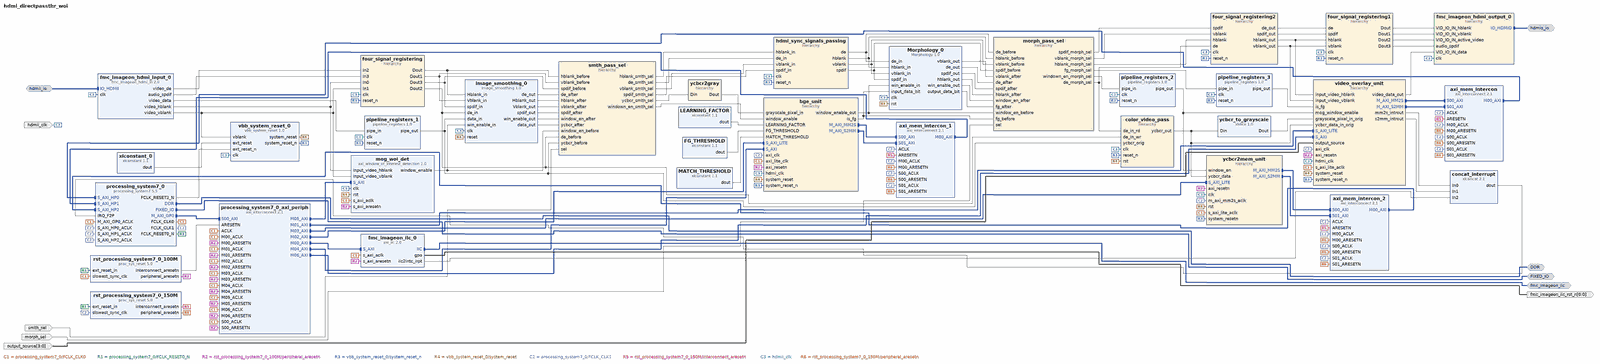
[diagram p0: block diagram of the top level, whole]
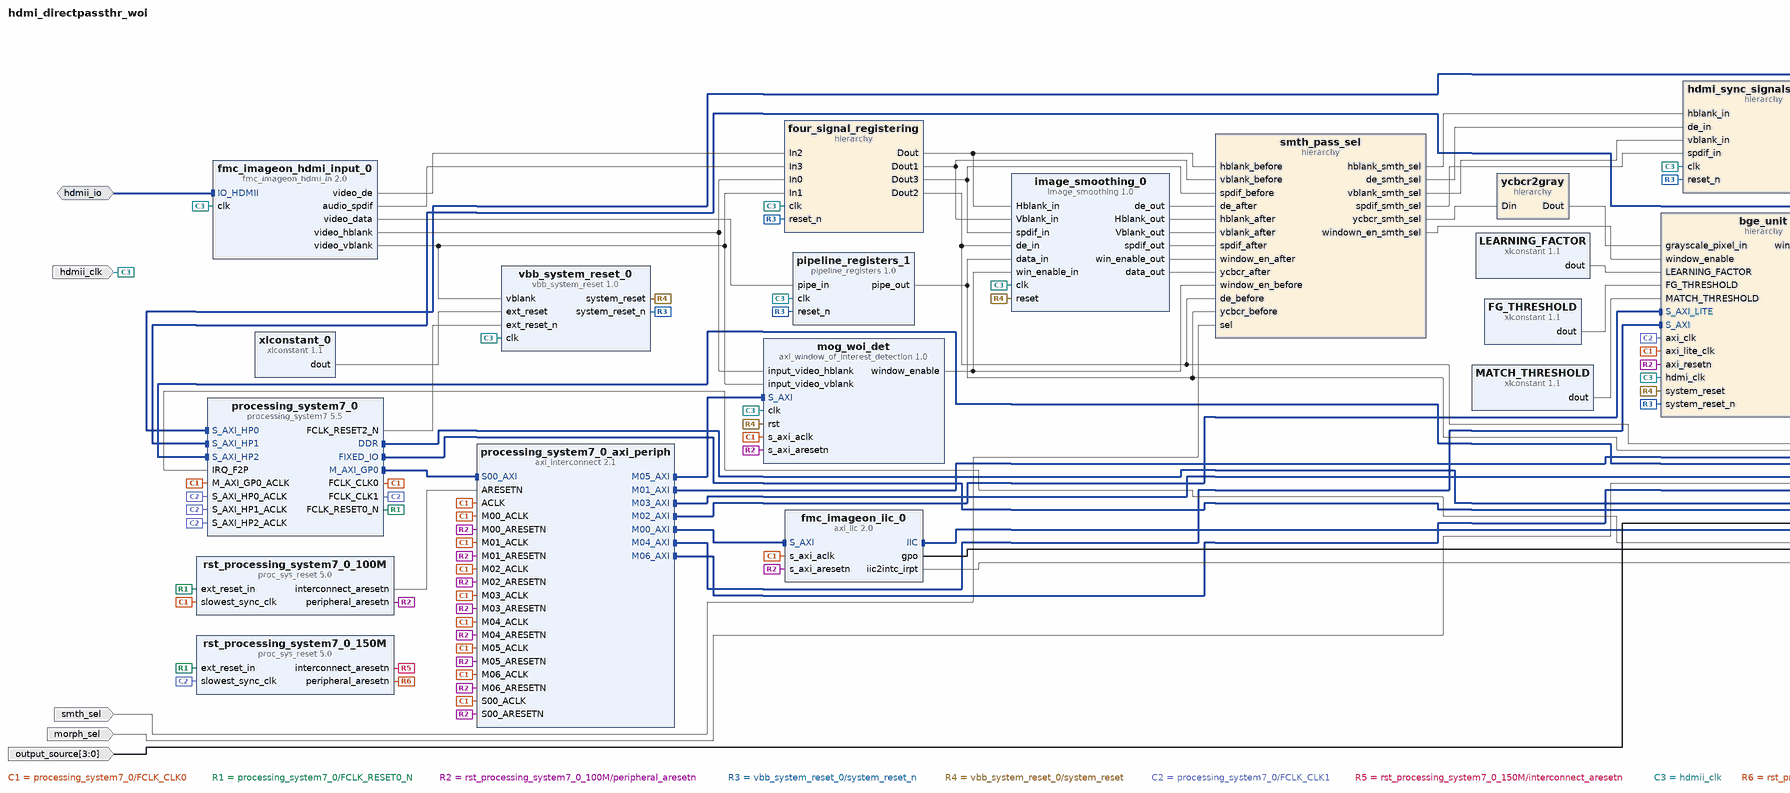
[diagram p1: block diagram of the top level, left part]
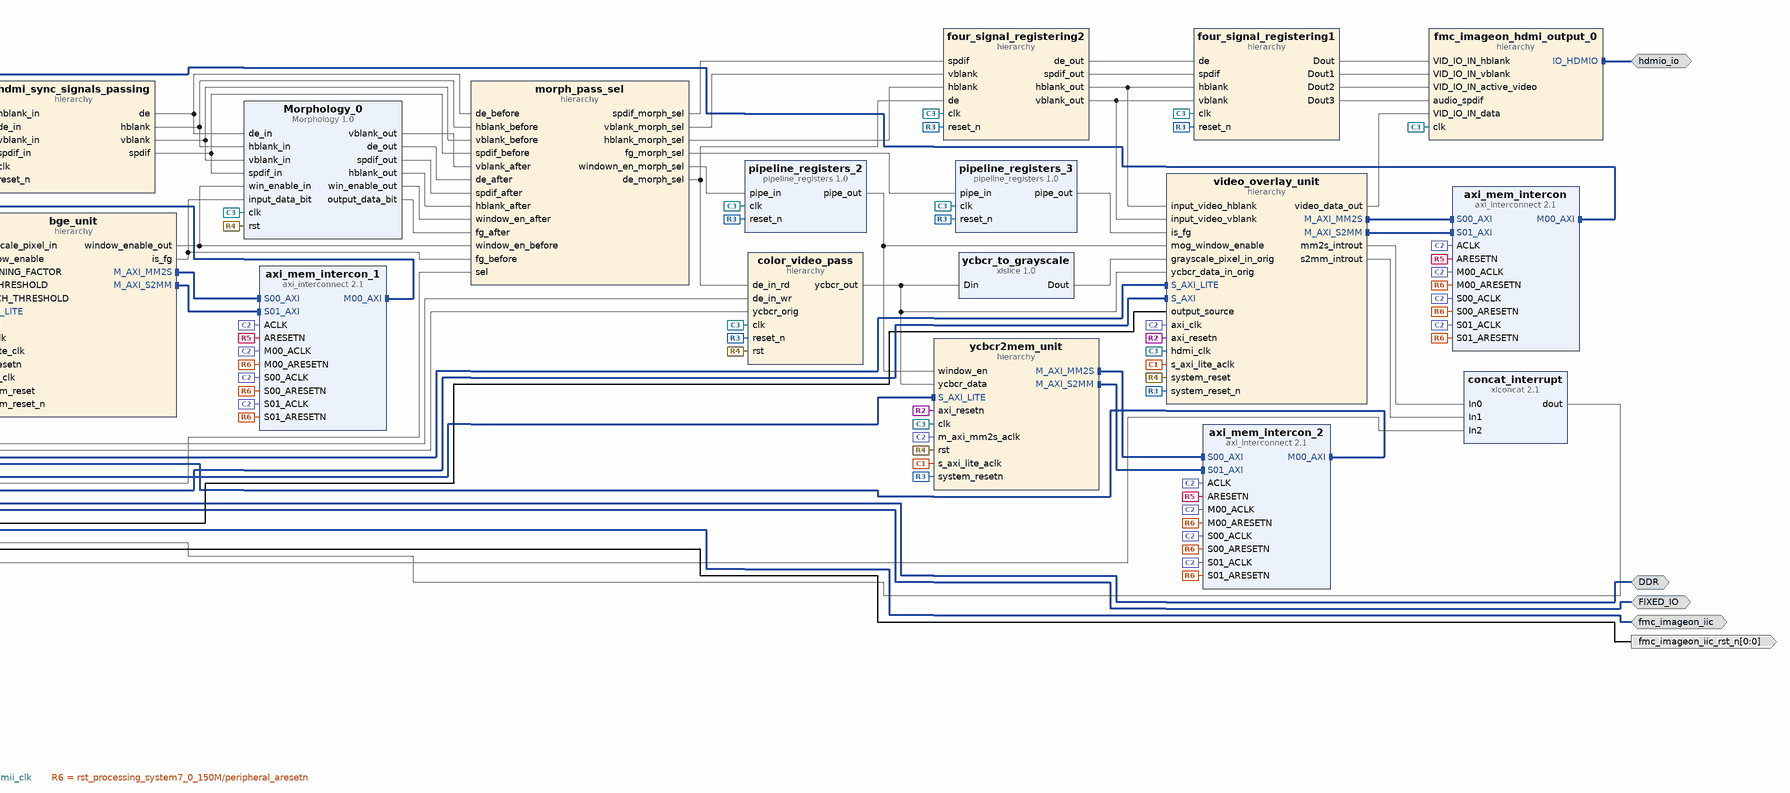
[diagram p2: block diagram of the top level, right part]
# Vivado block design hdmi_directpassthr_woi, xc7z020clg484-1, Vivado 2017.2
create_bd_design hdmi_directpassthr_woi

create_bd_intf_port -mode Master -vlnv xilinx.com:interface:ddrx_rtl:1.0 DDR
create_bd_intf_port -mode Master -vlnv xilinx.com:display_processing_system7:fixedio_rtl:1.0 FIXED_IO
create_bd_intf_port -mode Master -vlnv xilinx.com:interface:iic_rtl:1.0 fmc_imageon_iic
create_bd_intf_port -mode Slave -vlnv avnet.com:interface:avnet_hdmi_rtl:1.0 hdmii_io
create_bd_intf_port -mode Master -vlnv avnet.com:interface:avnet_hdmi_rtl:1.0 hdmio_io
create_bd_port -dir O -from 0 -to 0 fmc_imageon_iic_rst_n
create_bd_port -dir I -type clk hdmii_clk
create_bd_port -dir I smth_sel
create_bd_port -dir I morph_sel
create_bd_port -dir I -from 3 -to 0 output_source

create_bd_cell -type hier four_signal_registering
create_bd_cell -type hier four_signal_registering1
create_bd_cell -type ip -vlnv NEU-ESL:user:vbb_system_reset:1.0 vbb_system_reset_0
create_bd_cell -type hier video_overlay_unit
create_bd_cell -type hier bge_unit
create_bd_cell -type hier hdmi_sync_signals_passing
create_bd_cell -type hier color_video_pass
create_bd_cell -type ip -vlnv SchuylerEldridge:user:pipeline_registers:1.0 pipeline_registers_1
set_property -dict {CONFIG.NUMBER_OF_STAGES 2 CONFIG.BIT_WIDTH 16} [get_bd_cells pipeline_registers_1]
create_bd_cell -type hier four_signal_registering2
create_bd_cell -type ip -vlnv SchuylerEldridge:user:pipeline_registers:1.0 pipeline_registers_2
set_property -dict {CONFIG.NUMBER_OF_STAGES 1 CONFIG.BIT_WIDTH 1} [get_bd_cells pipeline_registers_2]
create_bd_cell -type ip -vlnv SchuylerEldridge:user:pipeline_registers:1.0 pipeline_registers_3
set_property -dict {CONFIG.NUMBER_OF_STAGES 1 CONFIG.BIT_WIDTH 1} [get_bd_cells pipeline_registers_3]
create_bd_cell -type ip -vlnv avnet:fmc_imageon:fmc_imageon_hdmi_in:2.0 fmc_imageon_hdmi_input_0
create_bd_cell -type hier fmc_imageon_hdmi_output_0
create_bd_cell -type hier ycbcr2gray
create_bd_cell -type hier ycbcr2mem_unit
create_bd_cell -type hier smth_pass_sel
create_bd_cell -type hier morph_pass_sel
create_bd_cell -type ip -vlnv NEU-ESL:user:axi_window_of_interest_detection:1.0 mog_woi_det
create_bd_cell -type ip -vlnv NEU-ESL:user:Morphology:1.0 Morphology_0
create_bd_cell -type ip -vlnv xilinx.com:ip:axi_iic:2.0 fmc_imageon_iic_0
create_bd_cell -type ip -vlnv xilinx.com:ip:axi_interconnect:2.1 axi_mem_intercon
set_property -dict {CONFIG.NUM_SI 2 CONFIG.NUM_MI 1} [get_bd_cells axi_mem_intercon]
create_bd_cell -type ip -vlnv xilinx.com:ip:axi_interconnect:2.1 axi_mem_intercon_1
set_property -dict {CONFIG.NUM_SI 2 CONFIG.NUM_MI 1} [get_bd_cells axi_mem_intercon_1]
create_bd_cell -type ip -vlnv xilinx.com:ip:axi_interconnect:2.1 axi_mem_intercon_2
set_property -dict {CONFIG.NUM_SI 2 CONFIG.NUM_MI 1} [get_bd_cells axi_mem_intercon_2]
create_bd_cell -type ip -vlnv NEU-ESL:user:image_smoothing:1.0 image_smoothing_0
create_bd_cell -type ip -vlnv xilinx.com:ip:processing_system7:5.5 processing_system7_0
set_property -dict [list \
  CONFIG.PCW_FCLK_CLK1_BUF TRUE \
  CONFIG.PCW_UIPARAM_DDR_FREQ_MHZ 533.333313 \
  CONFIG.PCW_APU_PERIPHERAL_FREQMHZ 666.666667 \
  CONFIG.PCW_SDIO_PERIPHERAL_FREQMHZ 50 \
  CONFIG.PCW_UART_PERIPHERAL_FREQMHZ 50 \
  CONFIG.PCW_FPGA0_PERIPHERAL_FREQMHZ 25.000000 \
  CONFIG.PCW_FPGA1_PERIPHERAL_FREQMHZ 125.000000 \
  CONFIG.PCW_USE_S_AXI_HP0 1 \
  CONFIG.PCW_USE_S_AXI_HP1 1 \
  CONFIG.PCW_USE_S_AXI_HP2 1 \
  CONFIG.PCW_M_AXI_GP0_FREQMHZ 25 \
  CONFIG.PCW_S_AXI_HP0_FREQMHZ 125 \
  CONFIG.PCW_S_AXI_HP1_FREQMHZ 125 \
  CONFIG.PCW_S_AXI_HP2_FREQMHZ 125 \
  CONFIG.PCW_USE_FABRIC_INTERRUPT 1 \
  CONFIG.PCW_S_AXI_HP0_DATA_WIDTH 32 \
  CONFIG.PCW_NUM_F2P_INTR_INPUTS 3 \
  CONFIG.PCW_EN_CLK1_PORT 1 \
  CONFIG.PCW_EN_RST2_PORT 1 \
  CONFIG.PCW_IRQ_F2P_INTR 1 \
  CONFIG.PCW_GP0_EN_MODIFIABLE_TXN 0 \
  CONFIG.PCW_GP1_EN_MODIFIABLE_TXN 0 \
  CONFIG.PCW_PRESET_BANK1_VOLTAGE {LVCMOS 1.8V} \
  CONFIG.PCW_UIPARAM_DDR_PARTNO {MT41J128M16 HA-15E} \
  CONFIG.PCW_QSPI_PERIPHERAL_ENABLE 1 \
  CONFIG.PCW_QSPI_QSPI_IO {MIO 1 .. 6} \
  CONFIG.PCW_QSPI_GRP_SINGLE_SS_ENABLE 1 \
  CONFIG.PCW_QSPI_GRP_SINGLE_SS_IO {MIO 1 .. 6} \
  CONFIG.PCW_QSPI_GRP_FBCLK_ENABLE 1 \
  CONFIG.PCW_QSPI_GRP_FBCLK_IO {MIO 8} \
  CONFIG.PCW_ENET0_PERIPHERAL_ENABLE 1 \
  CONFIG.PCW_ENET0_ENET0_IO {MIO 16 .. 27} \
  CONFIG.PCW_ENET0_GRP_MDIO_ENABLE 1 \
  CONFIG.PCW_ENET0_GRP_MDIO_IO {MIO 52 .. 53} \
  CONFIG.PCW_SD0_PERIPHERAL_ENABLE 1 \
  CONFIG.PCW_SD0_SD0_IO {MIO 40 .. 45} \
  CONFIG.PCW_SD0_GRP_CD_ENABLE 1 \
  CONFIG.PCW_SD0_GRP_CD_IO {MIO 47} \
  CONFIG.PCW_SD0_GRP_WP_ENABLE 1 \
  CONFIG.PCW_SD0_GRP_WP_IO {MIO 46} \
  CONFIG.PCW_UART1_PERIPHERAL_ENABLE 1 \
  CONFIG.PCW_UART1_UART1_IO {MIO 48 .. 49} \
  CONFIG.PCW_TRACE_INTERNAL_WIDTH 32 \
  CONFIG.PCW_TTC0_PERIPHERAL_ENABLE 1 \
  CONFIG.PCW_TTC0_TTC0_IO EMIO \
  CONFIG.PCW_USB0_PERIPHERAL_ENABLE 1 \
  CONFIG.PCW_USB0_USB0_IO {MIO 28 .. 39} \
  CONFIG.PCW_GPIO_MIO_GPIO_ENABLE 1 \
  CONFIG.PCW_GPIO_MIO_GPIO_IO MIO \
  CONFIG.preset ZedBoard \
  CONFIG.PCW_FPGA_FCLK1_ENABLE 1 \
] [get_bd_cells processing_system7_0]
# 215 more settings of processing_system7_0 are not shown: defaults, MIO pin electricals, DDR timing, and values the tool derives
create_bd_cell -type ip -vlnv xilinx.com:ip:axi_interconnect:2.1 processing_system7_0_axi_periph
set_property -dict {CONFIG.NUM_MI 7 CONFIG.ENABLE_ADVANCED_OPTIONS 0} [get_bd_cells processing_system7_0_axi_periph]
create_bd_cell -type ip -vlnv xilinx.com:ip:proc_sys_reset:5.0 rst_processing_system7_0_100M
set_property -dict {CONFIG.C_AUX_RESET_HIGH 0 CONFIG.C_EXT_RESET_HIGH 0} [get_bd_cells rst_processing_system7_0_100M]
create_bd_cell -type ip -vlnv xilinx.com:ip:proc_sys_reset:5.0 rst_processing_system7_0_150M
set_property -dict {CONFIG.C_AUX_RESET_HIGH 0 CONFIG.C_EXT_RESET_HIGH 0} [get_bd_cells rst_processing_system7_0_150M]
create_bd_cell -type ip -vlnv xilinx.com:ip:xlconcat:2.1 concat_interrupt
set_property -dict {CONFIG.NUM_PORTS 3 CONFIG.dout_width 3} [get_bd_cells concat_interrupt]
create_bd_cell -type ip -vlnv xilinx.com:ip:xlconstant:1.1 xlconstant_0
set_property -dict {CONFIG.CONST_VAL 0} [get_bd_cells xlconstant_0]
create_bd_cell -type ip -vlnv xilinx.com:ip:xlconstant:1.1 LEARNING_FACTOR
set_property -dict {CONFIG.CONST_WIDTH 16 CONFIG.CONST_VAL 5} [get_bd_cells LEARNING_FACTOR]
create_bd_cell -type ip -vlnv xilinx.com:ip:xlconstant:1.1 FG_THRESHOLD
set_property -dict {CONFIG.CONST_WIDTH 16 CONFIG.CONST_VAL 16383} [get_bd_cells FG_THRESHOLD]
create_bd_cell -type ip -vlnv xilinx.com:ip:xlconstant:1.1 MATCH_THRESHOLD
set_property -dict {CONFIG.CONST_WIDTH 8 CONFIG.CONST_VAL 85} [get_bd_cells MATCH_THRESHOLD]
create_bd_cell -type ip -vlnv xilinx.com:ip:xlslice:1.0 ycbcr_to_grayscale
set_property -dict {CONFIG.DIN_TO 8 CONFIG.DIN_FROM 15 CONFIG.DIN_WIDTH 16 CONFIG.DOUT_WIDTH 8} [get_bd_cells ycbcr_to_grayscale]

# ---- hierarchy /four_signal_registering ----
current_bd_instance /four_signal_registering
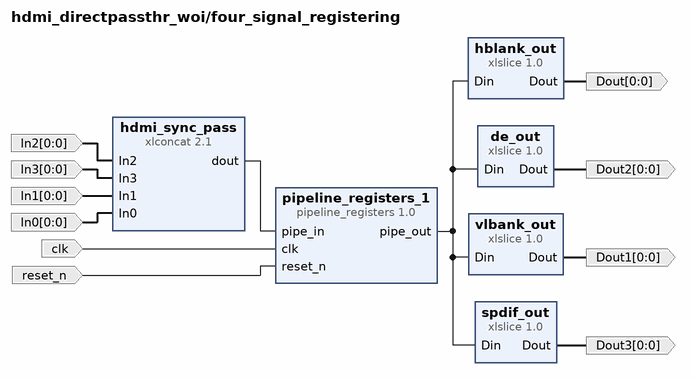
[diagram p3: block diagram inside /four_signal_registering]
create_bd_pin -dir I -from 0 -to 0 In2
create_bd_pin -dir I -from 0 -to 0 In3
create_bd_pin -dir I -from 0 -to 0 In1
create_bd_pin -dir I clk
create_bd_pin -dir I -from 0 -to 0 In0
create_bd_pin -dir I reset_n
create_bd_pin -dir O -from 0 -to 0 Dout
create_bd_pin -dir O -from 0 -to 0 Dout1
create_bd_pin -dir O -from 0 -to 0 Dout2
create_bd_pin -dir O -from 0 -to 0 Dout3

create_bd_cell -type ip -vlnv SchuylerEldridge:user:pipeline_registers:1.0 pipeline_registers_1
set_property -dict {CONFIG.NUMBER_OF_STAGES 2 CONFIG.BIT_WIDTH 4} [get_bd_cells pipeline_registers_1]
create_bd_cell -type ip -vlnv xilinx.com:ip:xlconcat:2.1 hdmi_sync_pass
set_property -dict {CONFIG.NUM_PORTS 4 CONFIG.dout_width 4} [get_bd_cells hdmi_sync_pass]
create_bd_cell -type ip -vlnv xilinx.com:ip:xlslice:1.0 hblank_out
set_property -dict {CONFIG.DIN_WIDTH 4} [get_bd_cells hblank_out]
create_bd_cell -type ip -vlnv xilinx.com:ip:xlslice:1.0 vlbank_out
set_property -dict {CONFIG.DIN_TO 1 CONFIG.DIN_FROM 1 CONFIG.DIN_WIDTH 4} [get_bd_cells vlbank_out]
create_bd_cell -type ip -vlnv xilinx.com:ip:xlslice:1.0 de_out
set_property -dict {CONFIG.DIN_TO 2 CONFIG.DIN_FROM 2 CONFIG.DIN_WIDTH 4} [get_bd_cells de_out]
create_bd_cell -type ip -vlnv xilinx.com:ip:xlslice:1.0 spdif_out
set_property -dict {CONFIG.DIN_TO 3 CONFIG.DIN_FROM 3 CONFIG.DIN_WIDTH 4} [get_bd_cells spdif_out]

# ---- hierarchy /four_signal_registering1 ----
current_bd_instance /four_signal_registering1
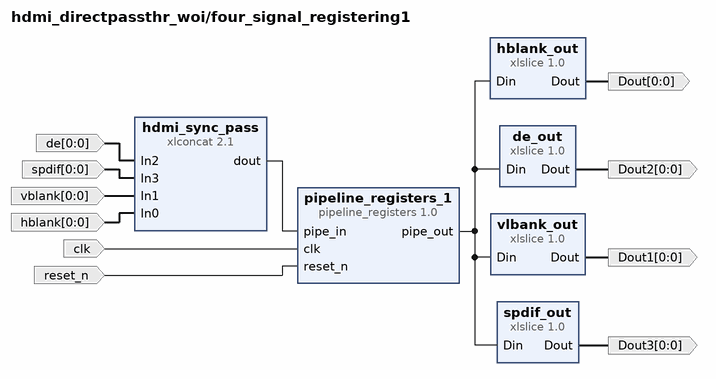
[diagram p4: block diagram inside /four_signal_registering1]
create_bd_pin -dir I -from 0 -to 0 de
create_bd_pin -dir I -from 0 -to 0 spdif
create_bd_pin -dir I -from 0 -to 0 vblank
create_bd_pin -dir I clk
create_bd_pin -dir I -from 0 -to 0 hblank
create_bd_pin -dir I reset_n
create_bd_pin -dir O -from 0 -to 0 Dout
create_bd_pin -dir O -from 0 -to 0 Dout1
create_bd_pin -dir O -from 0 -to 0 Dout2
create_bd_pin -dir O -from 0 -to 0 Dout3

create_bd_cell -type ip -vlnv SchuylerEldridge:user:pipeline_registers:1.0 pipeline_registers_1
set_property -dict {CONFIG.NUMBER_OF_STAGES 4 CONFIG.BIT_WIDTH 4} [get_bd_cells pipeline_registers_1]
create_bd_cell -type ip -vlnv xilinx.com:ip:xlslice:1.0 de_out
set_property -dict {CONFIG.DIN_TO 2 CONFIG.DIN_FROM 2 CONFIG.DIN_WIDTH 4} [get_bd_cells de_out]
create_bd_cell -type ip -vlnv xilinx.com:ip:xlslice:1.0 hblank_out
set_property -dict {CONFIG.DIN_WIDTH 4} [get_bd_cells hblank_out]
create_bd_cell -type ip -vlnv xilinx.com:ip:xlconcat:2.1 hdmi_sync_pass
set_property -dict {CONFIG.NUM_PORTS 4 CONFIG.dout_width 4} [get_bd_cells hdmi_sync_pass]
create_bd_cell -type ip -vlnv xilinx.com:ip:xlslice:1.0 spdif_out
set_property -dict {CONFIG.DIN_TO 3 CONFIG.DIN_FROM 3 CONFIG.DIN_WIDTH 4} [get_bd_cells spdif_out]
create_bd_cell -type ip -vlnv xilinx.com:ip:xlslice:1.0 vlbank_out
set_property -dict {CONFIG.DIN_TO 1 CONFIG.DIN_FROM 1 CONFIG.DIN_WIDTH 4} [get_bd_cells vlbank_out]

# ---- hierarchy /video_overlay_unit ----
current_bd_instance /video_overlay_unit
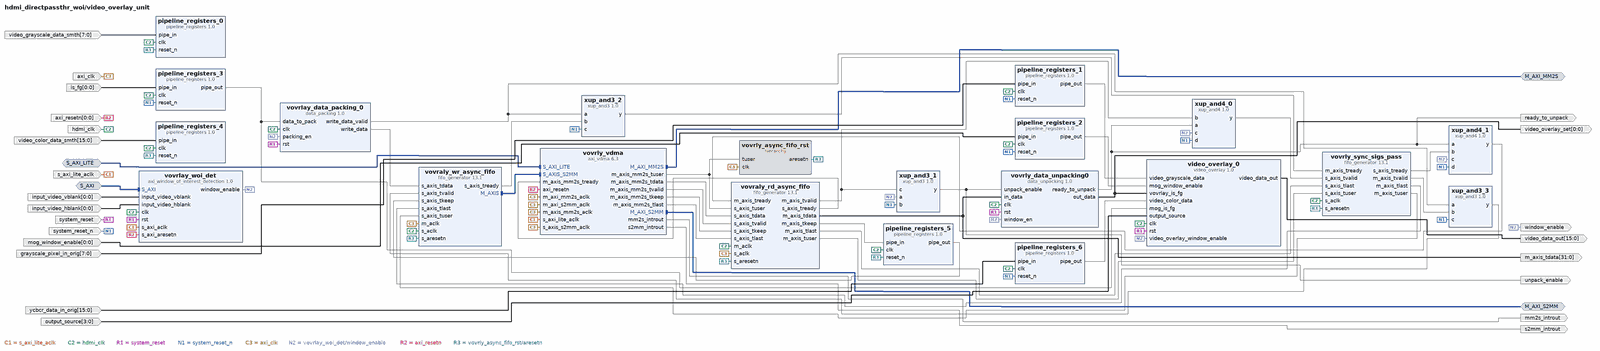
[diagram p5: block diagram inside /video_overlay_unit, whole]
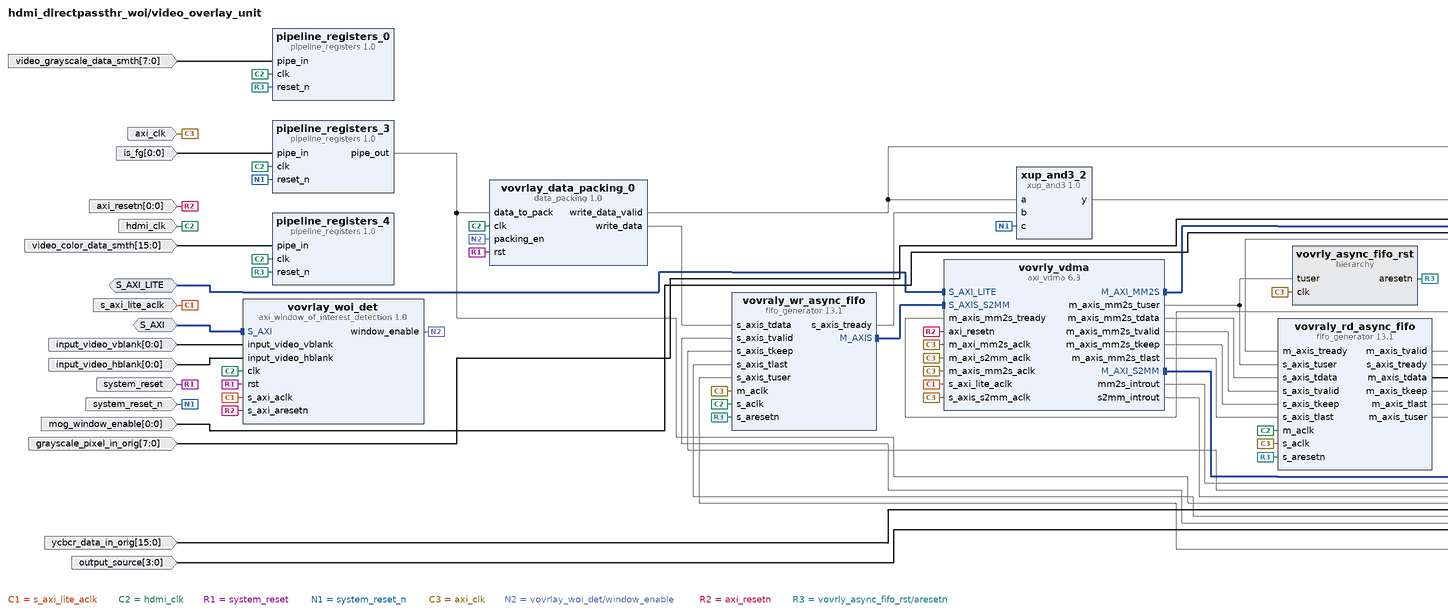
[diagram p6: block diagram inside /video_overlay_unit, left part]
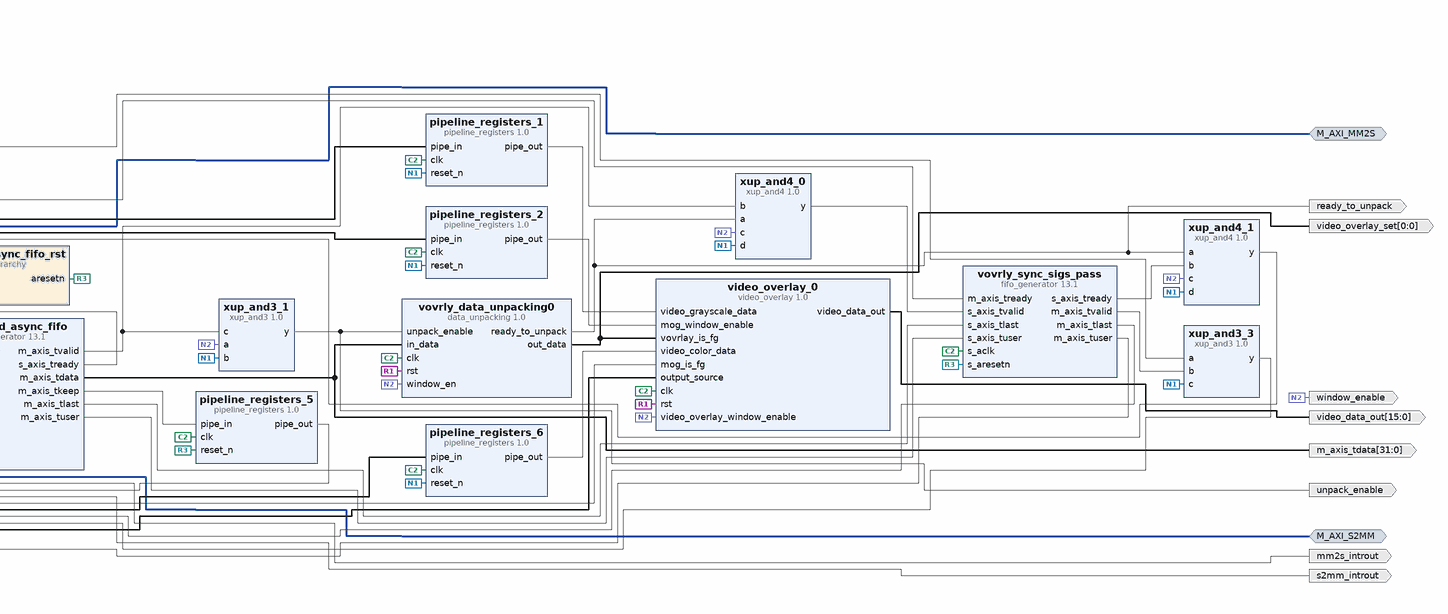
[diagram p7: block diagram inside /video_overlay_unit, right part]
create_bd_intf_pin -mode Master -vlnv xilinx.com:interface:aximm_rtl:1.0 M_AXI_MM2S
create_bd_intf_pin -mode Slave -vlnv xilinx.com:interface:aximm_rtl:1.0 S_AXI_LITE
create_bd_intf_pin -mode Master -vlnv xilinx.com:interface:aximm_rtl:1.0 M_AXI_S2MM
create_bd_intf_pin -mode Slave -vlnv xilinx.com:interface:aximm_rtl:1.0 S_AXI
create_bd_pin -dir I -type clk s_axi_lite_aclk
create_bd_pin -dir I hdmi_clk
create_bd_pin -dir I system_reset
create_bd_pin -dir I system_reset_n
create_bd_pin -dir O -from 15 -to 0 video_data_out
create_bd_pin -dir I -type clk axi_clk
create_bd_pin -dir I -from 0 -to 0 mog_window_enable
create_bd_pin -dir I -from 7 -to 0 grayscale_pixel_in_orig
create_bd_pin -dir I -from 0 -to 0 input_video_hblank
create_bd_pin -dir I -from 0 -to 0 input_video_vblank
create_bd_pin -dir I -from 0 -to 0 -type rst axi_resetn
create_bd_pin -dir O -from 31 -to 0 m_axis_tdata
create_bd_pin -dir O unpack_enable
create_bd_pin -dir O window_enable
create_bd_pin -dir O ready_to_unpack
create_bd_pin -dir O -from 0 -to 0 video_overlay_set
create_bd_pin -dir I -from 0 -to 0 is_fg
create_bd_pin -dir I -from 15 -to 0 ycbcr_data_in_orig
create_bd_pin -dir I -from 7 -to 0 video_grayscale_data_smth
create_bd_pin -dir I -from 15 -to 0 video_color_data_smth
create_bd_pin -dir O -type intr mm2s_introut
create_bd_pin -dir O -type intr s2mm_introut
create_bd_pin -dir I -from 3 -to 0 output_source

create_bd_cell -type ip -vlnv SchuylerEldridge:user:pipeline_registers:1.0 pipeline_registers_1
set_property -dict {CONFIG.NUMBER_OF_STAGES 3 CONFIG.BIT_WIDTH 8} [get_bd_cells pipeline_registers_1]
create_bd_cell -type ip -vlnv SchuylerEldridge:user:pipeline_registers:1.0 pipeline_registers_2
set_property -dict {CONFIG.NUMBER_OF_STAGES 3 CONFIG.BIT_WIDTH 1} [get_bd_cells pipeline_registers_2]
create_bd_cell -type ip -vlnv xilinx.com:xup:xup_and3:1.0 xup_and3_1
create_bd_cell -type hier vovrly_async_fifo_rst
create_bd_cell -type ip -vlnv SchuylerEldridge:user:pipeline_registers:1.0 pipeline_registers_3
set_property -dict {CONFIG.NUMBER_OF_STAGES 3 CONFIG.BIT_WIDTH 1} [get_bd_cells pipeline_registers_3]
create_bd_cell -type ip -vlnv xilinx.com:xup:xup_and4:1.0 xup_and4_0
create_bd_cell -type ip -vlnv xilinx.com:xup:xup_and3:1.0 xup_and3_2
create_bd_cell -type ip -vlnv xilinx.com:xup:xup_and3:1.0 xup_and3_3
create_bd_cell -type ip -vlnv NEU-ESL:user:data_packing:1.0 vovrlay_data_packing_0
create_bd_cell -type ip -vlnv xilinx.com:xup:xup_and4:1.0 xup_and4_1
create_bd_cell -type ip -vlnv SchuylerEldridge:user:pipeline_registers:1.0 pipeline_registers_5
set_property -dict {CONFIG.NUMBER_OF_STAGES 32 CONFIG.BIT_WIDTH 4} [get_bd_cells pipeline_registers_5]
create_bd_cell -type ip -vlnv SchuylerEldridge:user:pipeline_registers:1.0 pipeline_registers_6
set_property -dict {CONFIG.NUMBER_OF_STAGES 3 CONFIG.BIT_WIDTH 16} [get_bd_cells pipeline_registers_6]
create_bd_cell -type ip -vlnv NEU-ESL:user:data_unpacking:1.0 vovrly_data_unpacking0
set_property -dict {CONFIG.OUT_DATA_WIDTH 1} [get_bd_cells vovrly_data_unpacking0]
create_bd_cell -type ip -vlnv SchuylerEldridge:user:pipeline_registers:1.0 pipeline_registers_0
set_property -dict {CONFIG.NUMBER_OF_STAGES 3 CONFIG.BIT_WIDTH 8} [get_bd_cells pipeline_registers_0]
create_bd_cell -type ip -vlnv SchuylerEldridge:user:pipeline_registers:1.0 pipeline_registers_4
set_property -dict {CONFIG.NUMBER_OF_STAGES 3 CONFIG.BIT_WIDTH 16} [get_bd_cells pipeline_registers_4]
create_bd_cell -type ip -vlnv NEU-ESL:user:axi_window_of_interest_detection:1.0 vovrlay_woi_det
create_bd_cell -type ip -vlnv xilinx.com:ip:axi_vdma:6.3 vovrly_vdma
set_property -dict [list \
  CONFIG.c_m_axi_mm2s_data_width 32 \
  CONFIG.c_m_axi_s2mm_data_width 32 \
  CONFIG.c_num_fstores 2 \
  CONFIG.c_use_s2mm_fsync 0 \
  CONFIG.c_mm2s_genlock_mode 0 \
  CONFIG.c_s2mm_genlock_mode 0 \
  CONFIG.c_mm2s_linebuffer_depth 2048 \
  CONFIG.c_s2mm_linebuffer_depth 2048 \
  CONFIG.c_mm2s_max_burst_length 16 \
  CONFIG.c_s2mm_max_burst_length 16 \
  CONFIG.c_include_s2mm 1 \
  CONFIG.c_include_mm2s_dre 0 \
] [get_bd_cells vovrly_vdma]
create_bd_cell -type ip -vlnv xilinx.com:ip:fifo_generator:13.1 vovraly_rd_async_fifo
set_property -dict [list \
  CONFIG.INTERFACE_TYPE AXI_STREAM \
  CONFIG.Full_Flags_Reset_Value 1 \
  CONFIG.Clock_Type_AXI Independent_Clock \
  CONFIG.TDATA_NUM_BYTES 4 \
  CONFIG.TUSER_WIDTH 1 \
  CONFIG.Enable_TLAST true \
  CONFIG.HAS_TKEEP true \
  CONFIG.FIFO_Implementation_wach Independent_Clocks_Distributed_RAM \
  CONFIG.FIFO_Implementation_wdch Independent_Clocks_Block_RAM \
  CONFIG.FIFO_Implementation_wrch Independent_Clocks_Distributed_RAM \
  CONFIG.FIFO_Implementation_rach Independent_Clocks_Distributed_RAM \
  CONFIG.FIFO_Implementation_rdch Independent_Clocks_Block_RAM \
  CONFIG.FIFO_Implementation_axis Independent_Clocks_Block_RAM \
  CONFIG.Input_Depth_axis 1024 \
  CONFIG.Underflow_Flag_AXI false \
  CONFIG.Overflow_Flag_AXI false \
] [get_bd_cells vovraly_rd_async_fifo]
create_bd_cell -type ip -vlnv xilinx.com:ip:fifo_generator:13.1 vovrly_sync_sigs_pass
set_property -dict [list \
  CONFIG.INTERFACE_TYPE AXI_STREAM \
  CONFIG.Full_Flags_Reset_Value 1 \
  CONFIG.TDATA_NUM_BYTES 0 \
  CONFIG.TUSER_WIDTH 1 \
  CONFIG.Enable_TLAST true \
  CONFIG.FIFO_Implementation_wach Common_Clock_Distributed_RAM \
  CONFIG.FIFO_Implementation_wrch Common_Clock_Distributed_RAM \
  CONFIG.FIFO_Implementation_rach Common_Clock_Distributed_RAM \
  CONFIG.Input_Depth_axis 64 \
  CONFIG.Underflow_Flag_AXI true \
  CONFIG.Overflow_Flag_AXI true \
] [get_bd_cells vovrly_sync_sigs_pass]
create_bd_cell -type ip -vlnv xilinx.com:ip:fifo_generator:13.1 vovraly_wr_async_fifo
set_property -dict [list \
  CONFIG.INTERFACE_TYPE AXI_STREAM \
  CONFIG.Full_Flags_Reset_Value 1 \
  CONFIG.Clock_Type_AXI Independent_Clock \
  CONFIG.TDATA_NUM_BYTES 4 \
  CONFIG.TUSER_WIDTH 1 \
  CONFIG.Enable_TLAST true \
  CONFIG.HAS_TKEEP true \
  CONFIG.FIFO_Implementation_wach Independent_Clocks_Distributed_RAM \
  CONFIG.FIFO_Implementation_wdch Independent_Clocks_Block_RAM \
  CONFIG.FIFO_Implementation_wrch Independent_Clocks_Distributed_RAM \
  CONFIG.FIFO_Implementation_rach Independent_Clocks_Distributed_RAM \
  CONFIG.FIFO_Implementation_rdch Independent_Clocks_Block_RAM \
  CONFIG.FIFO_Implementation_axis Independent_Clocks_Block_RAM \
  CONFIG.Input_Depth_axis 512 \
  CONFIG.Underflow_Flag_AXI true \
  CONFIG.Overflow_Flag_AXI true \
] [get_bd_cells vovraly_wr_async_fifo]
create_bd_cell -type ip -vlnv www.northeastern.edu:user:video_overlay:1.0 video_overlay_0

# ---- hierarchy /video_overlay_unit/vovrly_async_fifo_rst ----
current_bd_instance /video_overlay_unit/vovrly_async_fifo_rst
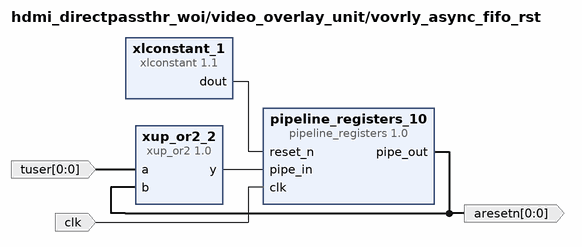
[diagram p8: block diagram inside /video_overlay_unit/vovrly_async_fifo_rst]
create_bd_pin -dir I clk
create_bd_pin -dir O -from 0 -to 0 aresetn
create_bd_pin -dir I -from 0 -to 0 tuser

create_bd_cell -type ip -vlnv SchuylerEldridge:user:pipeline_registers:1.0 pipeline_registers_10
set_property -dict {CONFIG.NUMBER_OF_STAGES 1 CONFIG.BIT_WIDTH 1} [get_bd_cells pipeline_registers_10]
create_bd_cell -type ip -vlnv xilinx.com:xup:xup_or2:1.0 xup_or2_2
create_bd_cell -type ip -vlnv xilinx.com:ip:xlconstant:1.1 xlconstant_1

# ---- hierarchy /bge_unit ----
current_bd_instance /bge_unit
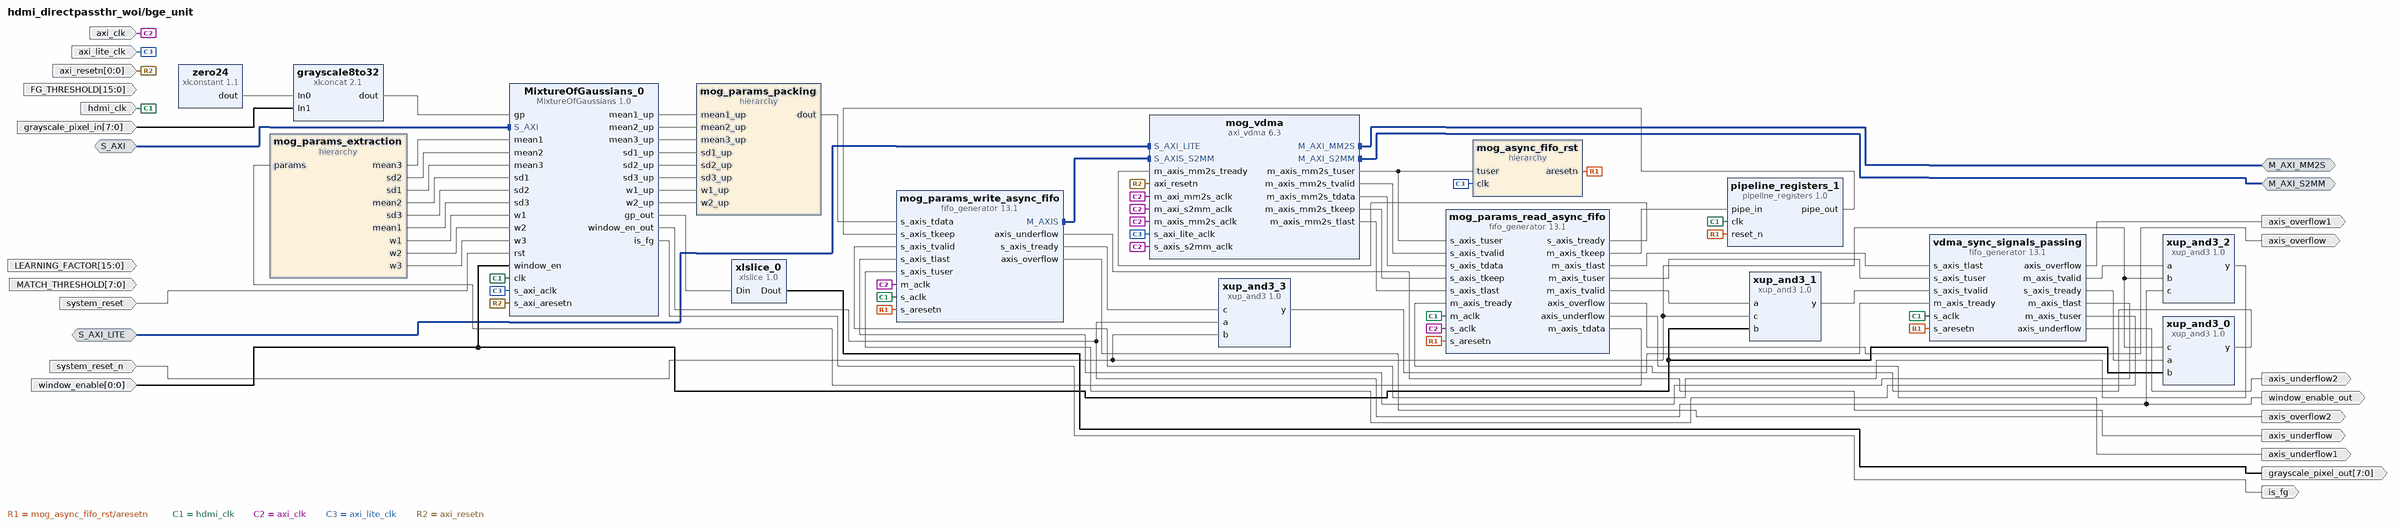
[diagram p9: block diagram inside /bge_unit]
create_bd_intf_pin -mode Slave -vlnv xilinx.com:interface:aximm_rtl:1.0 S_AXI_LITE
create_bd_intf_pin -mode Master -vlnv xilinx.com:interface:aximm_rtl:1.0 M_AXI_MM2S
create_bd_intf_pin -mode Master -vlnv xilinx.com:interface:aximm_rtl:1.0 M_AXI_S2MM
create_bd_intf_pin -mode Slave -vlnv xilinx.com:interface:aximm_rtl:1.0 S_AXI
create_bd_pin -dir I axi_lite_clk
create_bd_pin -dir I -from 0 -to 0 -type rst axi_resetn
create_bd_pin -dir I system_reset
create_bd_pin -dir I system_reset_n
create_bd_pin -dir I -type clk hdmi_clk
create_bd_pin -dir I -type clk axi_clk
create_bd_pin -dir I -from 7 -to 0 MATCH_THRESHOLD
create_bd_pin -dir I -from 7 -to 0 grayscale_pixel_in
create_bd_pin -dir I -from 0 -to 0 window_enable
create_bd_pin -dir I -from 15 -to 0 LEARNING_FACTOR
create_bd_pin -dir I -from 15 -to 0 FG_THRESHOLD
create_bd_pin -dir O window_enable_out
create_bd_pin -dir O -from 7 -to 0 grayscale_pixel_out
create_bd_pin -dir O is_fg
create_bd_pin -dir O axis_overflow
create_bd_pin -dir O axis_underflow
create_bd_pin -dir O axis_underflow1
create_bd_pin -dir O axis_overflow1
create_bd_pin -dir O axis_underflow2
create_bd_pin -dir O axis_overflow2

create_bd_cell -type ip -vlnv SchuylerEldridge:user:pipeline_registers:1.0 pipeline_registers_1
set_property -dict {CONFIG.NUMBER_OF_STAGES 80 CONFIG.BIT_WIDTH 16} [get_bd_cells pipeline_registers_1]
create_bd_cell -type hier mog_params_packing
create_bd_cell -type hier mog_params_extraction
create_bd_cell -type hier mog_async_fifo_rst
create_bd_cell -type ip -vlnv xilinx.com:xup:xup_and3:1.0 xup_and3_0
create_bd_cell -type ip -vlnv xilinx.com:xup:xup_and3:1.0 xup_and3_1
create_bd_cell -type ip -vlnv xilinx.com:xup:xup_and3:1.0 xup_and3_2
create_bd_cell -type ip -vlnv xilinx.com:xup:xup_and3:1.0 xup_and3_3
create_bd_cell -type ip -vlnv NEU-ESL:user:MixtureOfGaussians:1.0 MixtureOfGaussians_0
create_bd_cell -type ip -vlnv xilinx.com:ip:axi_vdma:6.3 mog_vdma
set_property -dict [list \
  CONFIG.c_m_axi_mm2s_data_width 128 \
  CONFIG.c_m_axis_mm2s_tdata_width 128 \
  CONFIG.c_m_axi_s2mm_data_width 128 \
  CONFIG.c_s_axis_s2mm_tdata_width 128 \
  CONFIG.c_num_fstores 1 \
  CONFIG.c_use_s2mm_fsync 0 \
  CONFIG.c_mm2s_genlock_mode 0 \
  CONFIG.c_s2mm_genlock_mode 0 \
  CONFIG.c_mm2s_linebuffer_depth 4096 \
  CONFIG.c_s2mm_linebuffer_depth 4096 \
  CONFIG.c_mm2s_max_burst_length 256 \
  CONFIG.c_s2mm_max_burst_length 256 \
] [get_bd_cells mog_vdma]
create_bd_cell -type ip -vlnv xilinx.com:ip:fifo_generator:13.1 mog_params_read_async_fifo
set_property -dict [list \
  CONFIG.INTERFACE_TYPE AXI_STREAM \
  CONFIG.Full_Flags_Reset_Value 1 \
  CONFIG.Clock_Type_AXI Independent_Clock \
  CONFIG.TDATA_NUM_BYTES 16 \
  CONFIG.TUSER_WIDTH 1 \
  CONFIG.Enable_TLAST true \
  CONFIG.HAS_TKEEP true \
  CONFIG.FIFO_Implementation_wach Independent_Clocks_Distributed_RAM \
  CONFIG.FIFO_Implementation_wdch Independent_Clocks_Block_RAM \
  CONFIG.FIFO_Implementation_wrch Independent_Clocks_Distributed_RAM \
  CONFIG.FIFO_Implementation_rach Independent_Clocks_Distributed_RAM \
  CONFIG.FIFO_Implementation_rdch Independent_Clocks_Block_RAM \
  CONFIG.FIFO_Implementation_axis Independent_Clocks_Block_RAM \
  CONFIG.Input_Depth_axis 1024 \
  CONFIG.Underflow_Flag_AXI true \
  CONFIG.Overflow_Flag_AXI true \
] [get_bd_cells mog_params_read_async_fifo]
create_bd_cell -type ip -vlnv xilinx.com:ip:fifo_generator:13.1 mog_params_write_async_fifo
set_property -dict [list \
  CONFIG.INTERFACE_TYPE AXI_STREAM \
  CONFIG.Full_Flags_Reset_Value 1 \
  CONFIG.Clock_Type_AXI Independent_Clock \
  CONFIG.TDATA_NUM_BYTES 16 \
  CONFIG.TUSER_WIDTH 1 \
  CONFIG.Enable_TLAST true \
  CONFIG.HAS_TKEEP true \
  CONFIG.FIFO_Implementation_wach Independent_Clocks_Distributed_RAM \
  CONFIG.FIFO_Implementation_wdch Independent_Clocks_Block_RAM \
  CONFIG.FIFO_Implementation_wrch Independent_Clocks_Distributed_RAM \
  CONFIG.FIFO_Implementation_rach Independent_Clocks_Distributed_RAM \
  CONFIG.FIFO_Implementation_rdch Independent_Clocks_Block_RAM \
  CONFIG.FIFO_Implementation_axis Independent_Clocks_Block_RAM \
  CONFIG.Input_Depth_axis 1024 \
  CONFIG.Underflow_Flag_AXI true \
  CONFIG.Overflow_Flag_AXI true \
] [get_bd_cells mog_params_write_async_fifo]
create_bd_cell -type ip -vlnv xilinx.com:ip:fifo_generator:13.1 vdma_sync_signals_passing
set_property -dict [list \
  CONFIG.INTERFACE_TYPE AXI_STREAM \
  CONFIG.Full_Flags_Reset_Value 1 \
  CONFIG.TDATA_NUM_BYTES 0 \
  CONFIG.TUSER_WIDTH 1 \
  CONFIG.Enable_TLAST true \
  CONFIG.FIFO_Implementation_wach Common_Clock_Distributed_RAM \
  CONFIG.FIFO_Implementation_wrch Common_Clock_Distributed_RAM \
  CONFIG.FIFO_Implementation_rach Common_Clock_Distributed_RAM \
  CONFIG.Input_Depth_axis 128 \
  CONFIG.Underflow_Flag_AXI true \
  CONFIG.Overflow_Flag_AXI true \
] [get_bd_cells vdma_sync_signals_passing]
create_bd_cell -type ip -vlnv xilinx.com:ip:xlconcat:2.1 grayscale8to32
set_property -dict {CONFIG.IN0_WIDTH 24 CONFIG.IN1_WIDTH 8 CONFIG.dout_width 32} [get_bd_cells grayscale8to32]
create_bd_cell -type ip -vlnv xilinx.com:ip:xlconstant:1.1 zero24
set_property -dict {CONFIG.CONST_WIDTH 24 CONFIG.CONST_VAL 0} [get_bd_cells zero24]
create_bd_cell -type ip -vlnv xilinx.com:ip:xlslice:1.0 xlslice_0
set_property -dict {CONFIG.DIN_TO 24 CONFIG.DIN_FROM 31 CONFIG.DOUT_WIDTH 8} [get_bd_cells xlslice_0]

# ---- hierarchy /bge_unit/mog_params_packing ----
current_bd_instance /bge_unit/mog_params_packing
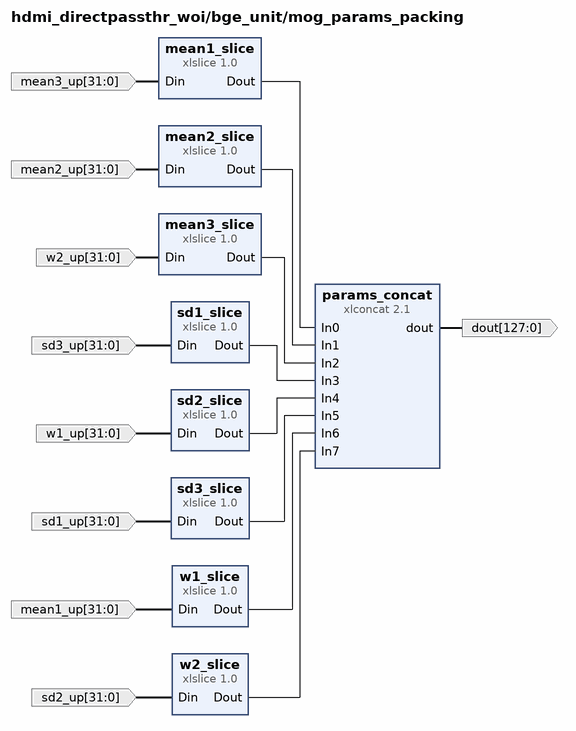
[diagram p10: block diagram inside /bge_unit/mog_params_packing]
create_bd_pin -dir I -from 31 -to 0 w2_up
create_bd_pin -dir I -from 31 -to 0 w1_up
create_bd_pin -dir I -from 31 -to 0 mean3_up
create_bd_pin -dir I -from 31 -to 0 sd1_up
create_bd_pin -dir I -from 31 -to 0 mean2_up
create_bd_pin -dir I -from 31 -to 0 mean1_up
create_bd_pin -dir I -from 31 -to 0 sd3_up
create_bd_pin -dir I -from 31 -to 0 sd2_up
create_bd_pin -dir O -from 127 -to 0 dout

create_bd_cell -type ip -vlnv xilinx.com:ip:xlslice:1.0 sd1_slice
set_property -dict {CONFIG.DIN_TO 16 CONFIG.DIN_FROM 31 CONFIG.DOUT_WIDTH 16} [get_bd_cells sd1_slice]
create_bd_cell -type ip -vlnv xilinx.com:ip:xlslice:1.0 w1_slice
set_property -dict {CONFIG.DIN_TO 16 CONFIG.DIN_FROM 31 CONFIG.DOUT_WIDTH 16} [get_bd_cells w1_slice]
create_bd_cell -type ip -vlnv xilinx.com:ip:xlslice:1.0 w2_slice
set_property -dict {CONFIG.DIN_TO 16 CONFIG.DIN_FROM 31 CONFIG.DOUT_WIDTH 16} [get_bd_cells w2_slice]
create_bd_cell -type ip -vlnv xilinx.com:ip:xlslice:1.0 sd3_slice
set_property -dict {CONFIG.DIN_TO 16 CONFIG.DIN_FROM 31 CONFIG.DOUT_WIDTH 16} [get_bd_cells sd3_slice]
create_bd_cell -type ip -vlnv xilinx.com:ip:xlslice:1.0 mean2_slice
set_property -dict {CONFIG.DIN_TO 16 CONFIG.DIN_FROM 31 CONFIG.DOUT_WIDTH 16} [get_bd_cells mean2_slice]
create_bd_cell -type ip -vlnv xilinx.com:ip:xlslice:1.0 sd2_slice
set_property -dict {CONFIG.DIN_TO 16 CONFIG.DIN_FROM 31 CONFIG.DOUT_WIDTH 16} [get_bd_cells sd2_slice]
create_bd_cell -type ip -vlnv xilinx.com:ip:xlslice:1.0 mean3_slice
set_property -dict {CONFIG.DIN_TO 16 CONFIG.DIN_FROM 31 CONFIG.DOUT_WIDTH 16} [get_bd_cells mean3_slice]
create_bd_cell -type ip -vlnv xilinx.com:ip:xlconcat:2.1 params_concat
set_property -dict [list \
  CONFIG.NUM_PORTS 8 \
  CONFIG.IN0_WIDTH 16 \
  CONFIG.IN1_WIDTH 16 \
  CONFIG.IN2_WIDTH 16 \
  CONFIG.IN3_WIDTH 16 \
  CONFIG.IN4_WIDTH 16 \
  CONFIG.IN5_WIDTH 16 \
  CONFIG.IN6_WIDTH 16 \
  CONFIG.IN7_WIDTH 16 \
  CONFIG.dout_width 128 \
] [get_bd_cells params_concat]
create_bd_cell -type ip -vlnv xilinx.com:ip:xlslice:1.0 mean1_slice
set_property -dict {CONFIG.DIN_TO 16 CONFIG.DIN_FROM 31 CONFIG.DOUT_WIDTH 16} [get_bd_cells mean1_slice]

# ---- hierarchy /bge_unit/mog_params_extraction ----
current_bd_instance /bge_unit/mog_params_extraction
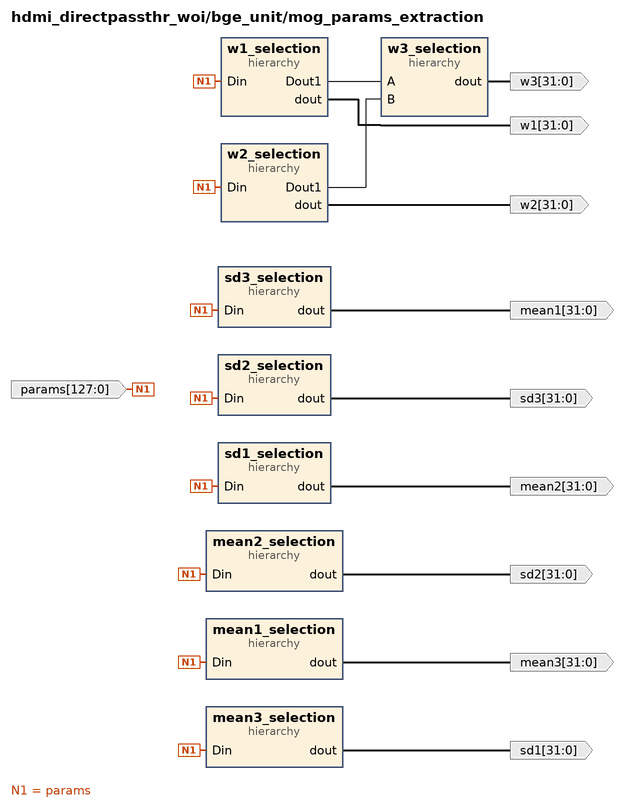
[diagram p11: block diagram inside /bge_unit/mog_params_extraction]
create_bd_pin -dir O -from 31 -to 0 -type data w1
create_bd_pin -dir O -from 31 -to 0 mean1
create_bd_pin -dir O -from 31 -to 0 sd3
create_bd_pin -dir O -from 31 -to 0 mean2
create_bd_pin -dir O -from 31 -to 0 -type data w2
create_bd_pin -dir I -from 127 -to 0 params
create_bd_pin -dir O -from 31 -to 0 sd2
create_bd_pin -dir O -from 31 -to 0 mean3
create_bd_pin -dir O -from 31 -to 0 sd1
create_bd_pin -dir O -from 31 -to 0 w3

create_bd_cell -type hier mean2_selection
create_bd_cell -type hier sd3_selection
create_bd_cell -type hier mean3_selection
create_bd_cell -type hier mean1_selection
create_bd_cell -type hier sd1_selection
create_bd_cell -type hier sd2_selection
create_bd_cell -type hier w2_selection
create_bd_cell -type hier w1_selection
create_bd_cell -type hier w3_selection

# ---- hierarchy /bge_unit/mog_params_extraction/mean2_selection ----
current_bd_instance /bge_unit/mog_params_extraction/mean2_selection
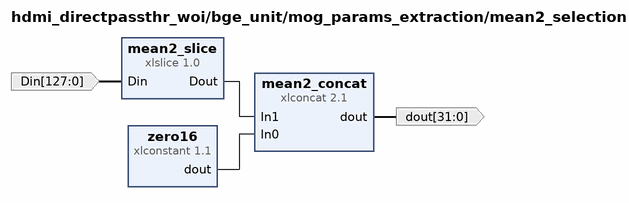
[diagram p12: block diagram inside /bge_unit/mog_params_extraction/mean2_selection]
create_bd_pin -dir I -from 127 -to 0 Din
create_bd_pin -dir O -from 31 -to 0 dout

create_bd_cell -type ip -vlnv xilinx.com:ip:xlconcat:2.1 mean2_concat
set_property -dict {CONFIG.IN0_WIDTH 16 CONFIG.IN1_WIDTH 16 CONFIG.dout_width 32} [get_bd_cells mean2_concat]
create_bd_cell -type ip -vlnv xilinx.com:ip:xlslice:1.0 mean2_slice
set_property -dict {CONFIG.DIN_TO 16 CONFIG.DIN_FROM 31 CONFIG.DIN_WIDTH 128 CONFIG.DOUT_WIDTH 16} [get_bd_cells mean2_slice]
create_bd_cell -type ip -vlnv xilinx.com:ip:xlconstant:1.1 zero16
set_property -dict {CONFIG.CONST_WIDTH 16 CONFIG.CONST_VAL 0} [get_bd_cells zero16]

# ---- hierarchy /bge_unit/mog_params_extraction/sd3_selection ----
current_bd_instance /bge_unit/mog_params_extraction/sd3_selection
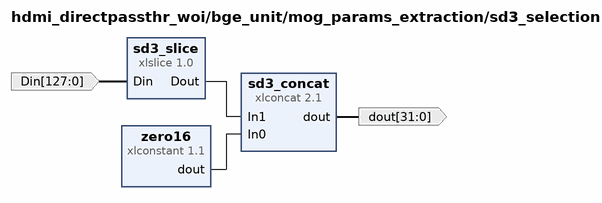
[diagram p13: block diagram inside /bge_unit/mog_params_extraction/sd3_selection]
create_bd_pin -dir I -from 127 -to 0 Din
create_bd_pin -dir O -from 31 -to 0 dout

create_bd_cell -type ip -vlnv xilinx.com:ip:xlconcat:2.1 sd3_concat
set_property -dict {CONFIG.IN0_WIDTH 16 CONFIG.IN1_WIDTH 16 CONFIG.dout_width 32} [get_bd_cells sd3_concat]
create_bd_cell -type ip -vlnv xilinx.com:ip:xlslice:1.0 sd3_slice
set_property -dict {CONFIG.DIN_TO 80 CONFIG.DIN_FROM 95 CONFIG.DIN_WIDTH 128 CONFIG.DOUT_WIDTH 1} [get_bd_cells sd3_slice]
create_bd_cell -type ip -vlnv xilinx.com:ip:xlconstant:1.1 zero16
set_property -dict {CONFIG.CONST_WIDTH 16 CONFIG.CONST_VAL 0} [get_bd_cells zero16]

# ---- hierarchy /bge_unit/mog_params_extraction/mean3_selection ----
current_bd_instance /bge_unit/mog_params_extraction/mean3_selection
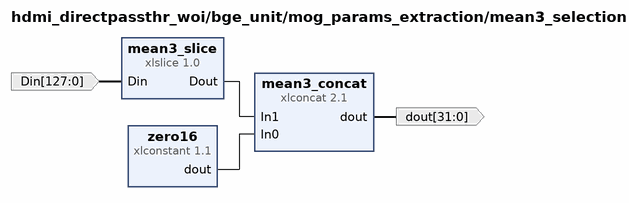
[diagram p14: block diagram inside /bge_unit/mog_params_extraction/mean3_selection]
create_bd_pin -dir I -from 127 -to 0 Din
create_bd_pin -dir O -from 31 -to 0 dout

create_bd_cell -type ip -vlnv xilinx.com:ip:xlconcat:2.1 mean3_concat
set_property -dict {CONFIG.IN0_WIDTH 16 CONFIG.IN1_WIDTH 16 CONFIG.dout_width 32} [get_bd_cells mean3_concat]
create_bd_cell -type ip -vlnv xilinx.com:ip:xlslice:1.0 mean3_slice
set_property -dict {CONFIG.DIN_TO 32 CONFIG.DIN_FROM 47 CONFIG.DIN_WIDTH 128 CONFIG.DOUT_WIDTH 1} [get_bd_cells mean3_slice]
create_bd_cell -type ip -vlnv xilinx.com:ip:xlconstant:1.1 zero16
set_property -dict {CONFIG.CONST_WIDTH 16 CONFIG.CONST_VAL 0} [get_bd_cells zero16]

# ---- hierarchy /bge_unit/mog_params_extraction/mean1_selection ----
current_bd_instance /bge_unit/mog_params_extraction/mean1_selection
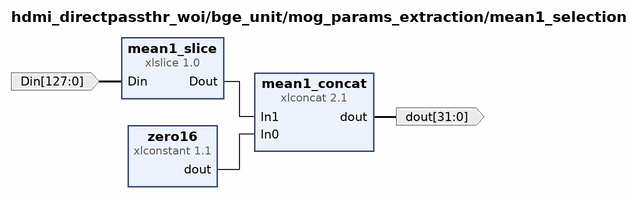
[diagram p15: block diagram inside /bge_unit/mog_params_extraction/mean1_selection]
create_bd_pin -dir I -from 127 -to 0 Din
create_bd_pin -dir O -from 31 -to 0 dout

create_bd_cell -type ip -vlnv xilinx.com:ip:xlconcat:2.1 mean1_concat
set_property -dict {CONFIG.IN0_WIDTH 16 CONFIG.IN1_WIDTH 16 CONFIG.dout_width 32} [get_bd_cells mean1_concat]
create_bd_cell -type ip -vlnv xilinx.com:ip:xlconstant:1.1 zero16
set_property -dict {CONFIG.CONST_WIDTH 16 CONFIG.CONST_VAL 0} [get_bd_cells zero16]
create_bd_cell -type ip -vlnv xilinx.com:ip:xlslice:1.0 mean1_slice
set_property -dict {CONFIG.DIN_FROM 15 CONFIG.DIN_WIDTH 128 CONFIG.DOUT_WIDTH 16} [get_bd_cells mean1_slice]

# ---- hierarchy /bge_unit/mog_params_extraction/sd1_selection ----
current_bd_instance /bge_unit/mog_params_extraction/sd1_selection
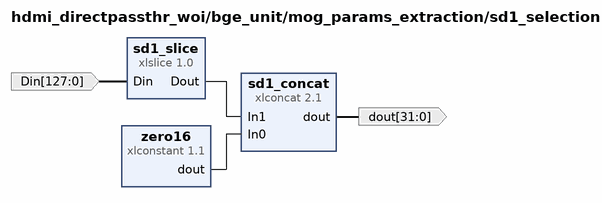
[diagram p16: block diagram inside /bge_unit/mog_params_extraction/sd1_selection]
create_bd_pin -dir I -from 127 -to 0 Din
create_bd_pin -dir O -from 31 -to 0 dout

create_bd_cell -type ip -vlnv xilinx.com:ip:xlconcat:2.1 sd1_concat
set_property -dict {CONFIG.IN0_WIDTH 16 CONFIG.IN1_WIDTH 16 CONFIG.dout_width 32} [get_bd_cells sd1_concat]
create_bd_cell -type ip -vlnv xilinx.com:ip:xlslice:1.0 sd1_slice
set_property -dict {CONFIG.DIN_TO 48 CONFIG.DIN_FROM 63 CONFIG.DIN_WIDTH 128 CONFIG.DOUT_WIDTH 1} [get_bd_cells sd1_slice]
create_bd_cell -type ip -vlnv xilinx.com:ip:xlconstant:1.1 zero16
set_property -dict {CONFIG.CONST_WIDTH 16 CONFIG.CONST_VAL 0} [get_bd_cells zero16]

# ---- hierarchy /bge_unit/mog_params_extraction/sd2_selection ----
current_bd_instance /bge_unit/mog_params_extraction/sd2_selection
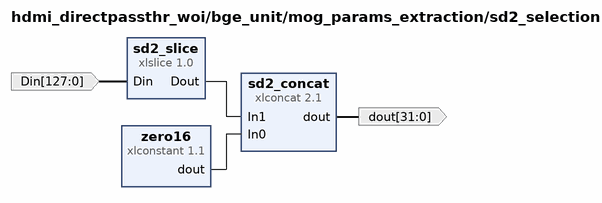
[diagram p17: block diagram inside /bge_unit/mog_params_extraction/sd2_selection]
create_bd_pin -dir I -from 127 -to 0 Din
create_bd_pin -dir O -from 31 -to 0 dout

create_bd_cell -type ip -vlnv xilinx.com:ip:xlconcat:2.1 sd2_concat
set_property -dict {CONFIG.IN0_WIDTH 16 CONFIG.IN1_WIDTH 16 CONFIG.dout_width 32} [get_bd_cells sd2_concat]
create_bd_cell -type ip -vlnv xilinx.com:ip:xlslice:1.0 sd2_slice
set_property -dict {CONFIG.DIN_TO 64 CONFIG.DIN_FROM 79 CONFIG.DIN_WIDTH 128 CONFIG.DOUT_WIDTH 1} [get_bd_cells sd2_slice]
create_bd_cell -type ip -vlnv xilinx.com:ip:xlconstant:1.1 zero16
set_property -dict {CONFIG.CONST_WIDTH 16 CONFIG.CONST_VAL 0} [get_bd_cells zero16]

# ---- hierarchy /bge_unit/mog_params_extraction/w2_selection ----
current_bd_instance /bge_unit/mog_params_extraction/w2_selection
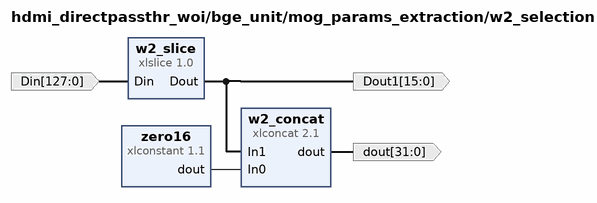
[diagram p18: block diagram inside /bge_unit/mog_params_extraction/w2_selection]
create_bd_pin -dir I -from 127 -to 0 Din
create_bd_pin -dir O -from 31 -to 0 dout
create_bd_pin -dir O -from 15 -to 0 Dout1

create_bd_cell -type ip -vlnv xilinx.com:ip:xlconcat:2.1 w2_concat
set_property -dict {CONFIG.IN0_WIDTH 16 CONFIG.IN1_WIDTH 16 CONFIG.dout_width 32} [get_bd_cells w2_concat]
create_bd_cell -type ip -vlnv xilinx.com:ip:xlslice:1.0 w2_slice
set_property -dict {CONFIG.DIN_TO 112 CONFIG.DIN_FROM 127 CONFIG.DIN_WIDTH 128 CONFIG.DOUT_WIDTH 1} [get_bd_cells w2_slice]
create_bd_cell -type ip -vlnv xilinx.com:ip:xlconstant:1.1 zero16
set_property -dict {CONFIG.CONST_WIDTH 16 CONFIG.CONST_VAL 0} [get_bd_cells zero16]

# ---- hierarchy /bge_unit/mog_params_extraction/w1_selection ----
current_bd_instance /bge_unit/mog_params_extraction/w1_selection
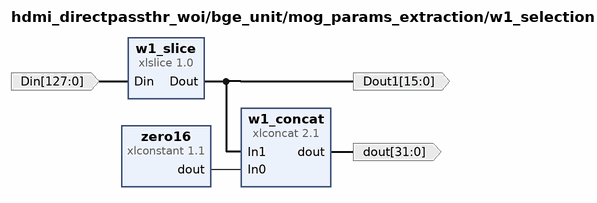
[diagram p19: block diagram inside /bge_unit/mog_params_extraction/w1_selection]
create_bd_pin -dir I -from 127 -to 0 Din
create_bd_pin -dir O -from 31 -to 0 dout
create_bd_pin -dir O -from 15 -to 0 Dout1

create_bd_cell -type ip -vlnv xilinx.com:ip:xlconcat:2.1 w1_concat
set_property -dict {CONFIG.IN0_WIDTH 16 CONFIG.IN1_WIDTH 16 CONFIG.dout_width 32} [get_bd_cells w1_concat]
create_bd_cell -type ip -vlnv xilinx.com:ip:xlslice:1.0 w1_slice
set_property -dict {CONFIG.DIN_TO 96 CONFIG.DIN_FROM 111 CONFIG.DIN_WIDTH 128 CONFIG.DOUT_WIDTH 1} [get_bd_cells w1_slice]
create_bd_cell -type ip -vlnv xilinx.com:ip:xlconstant:1.1 zero16
set_property -dict {CONFIG.CONST_WIDTH 16 CONFIG.CONST_VAL 0} [get_bd_cells zero16]

# ---- hierarchy /bge_unit/mog_params_extraction/w3_selection ----
current_bd_instance /bge_unit/mog_params_extraction/w3_selection
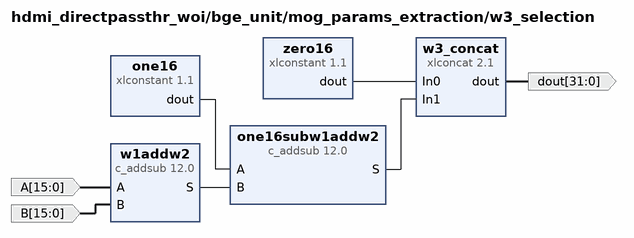
[diagram p20: block diagram inside /bge_unit/mog_params_extraction/w3_selection]
create_bd_pin -dir I -from 15 -to 0 A
create_bd_pin -dir I -from 15 -to 0 B
create_bd_pin -dir O -from 31 -to 0 dout

create_bd_cell -type ip -vlnv xilinx.com:ip:c_addsub:12.0 w1addw2
set_property -dict [list \
  CONFIG.A_Type Unsigned \
  CONFIG.B_Type Unsigned \
  CONFIG.A_Width 16 \
  CONFIG.B_Width 16 \
  CONFIG.Out_Width 16 \
  CONFIG.Latency 0 \
  CONFIG.B_Value 0000000000000000 \
  CONFIG.CE false \
] [get_bd_cells w1addw2]
create_bd_cell -type ip -vlnv xilinx.com:ip:c_addsub:12.0 one16subw1addw2
set_property -dict [list \
  CONFIG.A_Type Unsigned \
  CONFIG.B_Type Unsigned \
  CONFIG.A_Width 16 \
  CONFIG.B_Width 16 \
  CONFIG.Add_Mode Subtract \
  CONFIG.Out_Width 16 \
  CONFIG.Latency 0 \
  CONFIG.B_Value 0000000000000000 \
  CONFIG.CE false \
] [get_bd_cells one16subw1addw2]
create_bd_cell -type ip -vlnv xilinx.com:ip:xlconcat:2.1 w3_concat
set_property -dict {CONFIG.IN0_WIDTH 16 CONFIG.IN1_WIDTH 16 CONFIG.dout_width 32} [get_bd_cells w3_concat]
create_bd_cell -type ip -vlnv xilinx.com:ip:xlconstant:1.1 zero16
set_property -dict {CONFIG.CONST_WIDTH 16 CONFIG.CONST_VAL 0} [get_bd_cells zero16]
create_bd_cell -type ip -vlnv xilinx.com:ip:xlconstant:1.1 one16
set_property -dict {CONFIG.CONST_WIDTH 16 CONFIG.CONST_VAL 65535} [get_bd_cells one16]

# ---- hierarchy /bge_unit/mog_async_fifo_rst ----
current_bd_instance /bge_unit/mog_async_fifo_rst
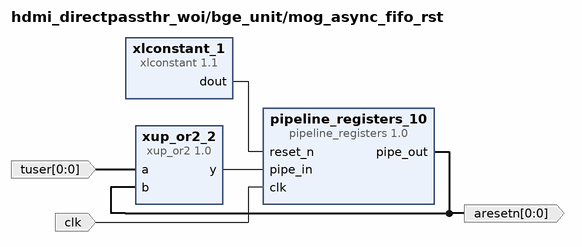
[diagram p21: block diagram inside /bge_unit/mog_async_fifo_rst]
create_bd_pin -dir I clk
create_bd_pin -dir O -from 0 -to 0 aresetn
create_bd_pin -dir I -from 0 -to 0 tuser

create_bd_cell -type ip -vlnv SchuylerEldridge:user:pipeline_registers:1.0 pipeline_registers_10
set_property -dict {CONFIG.NUMBER_OF_STAGES 1 CONFIG.BIT_WIDTH 1} [get_bd_cells pipeline_registers_10]
create_bd_cell -type ip -vlnv xilinx.com:xup:xup_or2:1.0 xup_or2_2
create_bd_cell -type ip -vlnv xilinx.com:ip:xlconstant:1.1 xlconstant_1

# ---- hierarchy /hdmi_sync_signals_passing ----
current_bd_instance /hdmi_sync_signals_passing
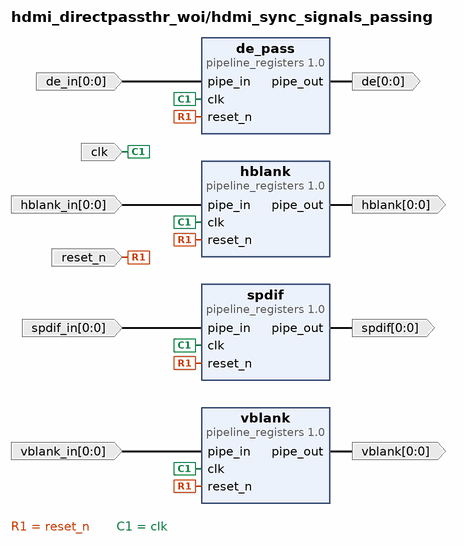
[diagram p22: block diagram inside /hdmi_sync_signals_passing]
create_bd_pin -dir O -from 0 -to 0 vblank
create_bd_pin -dir O -from 0 -to 0 hblank
create_bd_pin -dir I reset_n
create_bd_pin -dir I clk
create_bd_pin -dir O -from 0 -to 0 spdif
create_bd_pin -dir I -from 0 -to 0 hblank_in
create_bd_pin -dir I -from 0 -to 0 de_in
create_bd_pin -dir I -from 0 -to 0 vblank_in
create_bd_pin -dir I -from 0 -to 0 spdif_in
create_bd_pin -dir O -from 0 -to 0 de

create_bd_cell -type ip -vlnv SchuylerEldridge:user:pipeline_registers:1.0 spdif
set_property -dict {CONFIG.NUMBER_OF_STAGES 80 CONFIG.BIT_WIDTH 1} [get_bd_cells spdif]
create_bd_cell -type ip -vlnv SchuylerEldridge:user:pipeline_registers:1.0 vblank
set_property -dict {CONFIG.NUMBER_OF_STAGES 80 CONFIG.BIT_WIDTH 1} [get_bd_cells vblank]
create_bd_cell -type ip -vlnv SchuylerEldridge:user:pipeline_registers:1.0 de_pass
set_property -dict {CONFIG.NUMBER_OF_STAGES 80 CONFIG.BIT_WIDTH 1} [get_bd_cells de_pass]
create_bd_cell -type ip -vlnv SchuylerEldridge:user:pipeline_registers:1.0 hblank
set_property -dict {CONFIG.NUMBER_OF_STAGES 80 CONFIG.BIT_WIDTH 1} [get_bd_cells hblank]

# ---- hierarchy /color_video_pass ----
current_bd_instance /color_video_pass
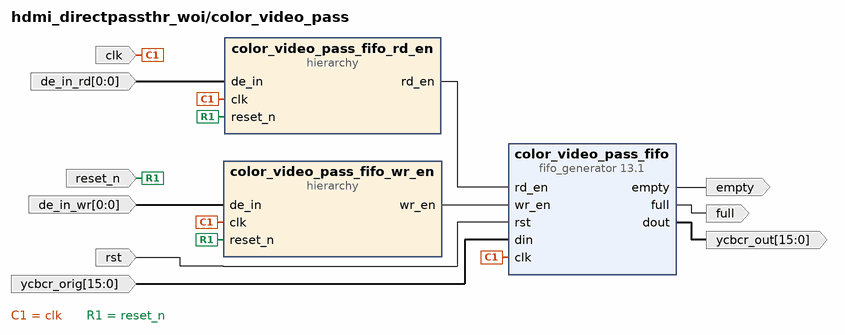
[diagram p23: block diagram inside /color_video_pass]
create_bd_pin -dir I rst
create_bd_pin -dir I clk
create_bd_pin -dir I -from 0 -to 0 de_in_wr
create_bd_pin -dir I -from 0 -to 0 de_in_rd
create_bd_pin -dir I reset_n
create_bd_pin -dir O full
create_bd_pin -dir O empty
create_bd_pin -dir I -from 15 -to 0 ycbcr_orig
create_bd_pin -dir O -from 15 -to 0 ycbcr_out

create_bd_cell -type hier color_video_pass_fifo_wr_en
create_bd_cell -type hier color_video_pass_fifo_rd_en
create_bd_cell -type ip -vlnv xilinx.com:ip:fifo_generator:13.1 color_video_pass_fifo
set_property -dict [list \
  CONFIG.Input_Data_Width 16 \
  CONFIG.Input_Depth 65536 \
  CONFIG.Output_Data_Width 16 \
  CONFIG.Reset_Type Asynchronous_Reset \
  CONFIG.Full_Flags_Reset_Value 1 \
  CONFIG.Almost_Full_Flag false \
] [get_bd_cells color_video_pass_fifo]

# ---- hierarchy /color_video_pass/color_video_pass_fifo_wr_en ----
current_bd_instance /color_video_pass/color_video_pass_fifo_wr_en
